# EAGLE design v2 (EAGLE 9.2.0)
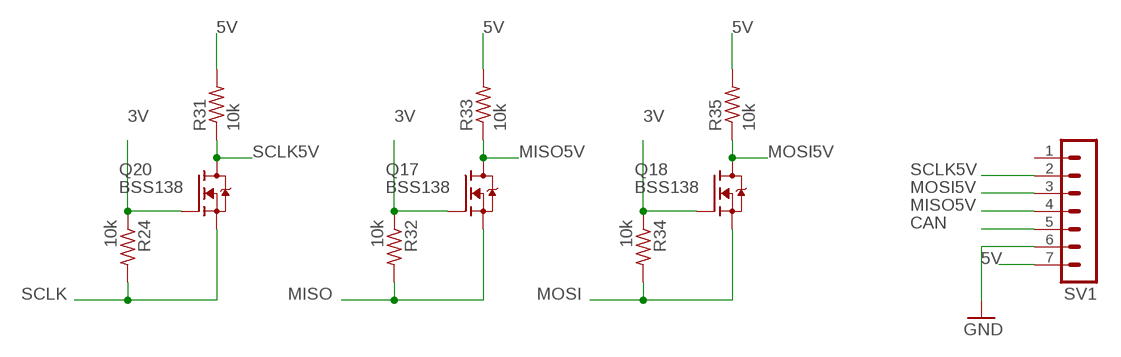
[diagram p0: schematic, sheet 1, part 1 of 2]
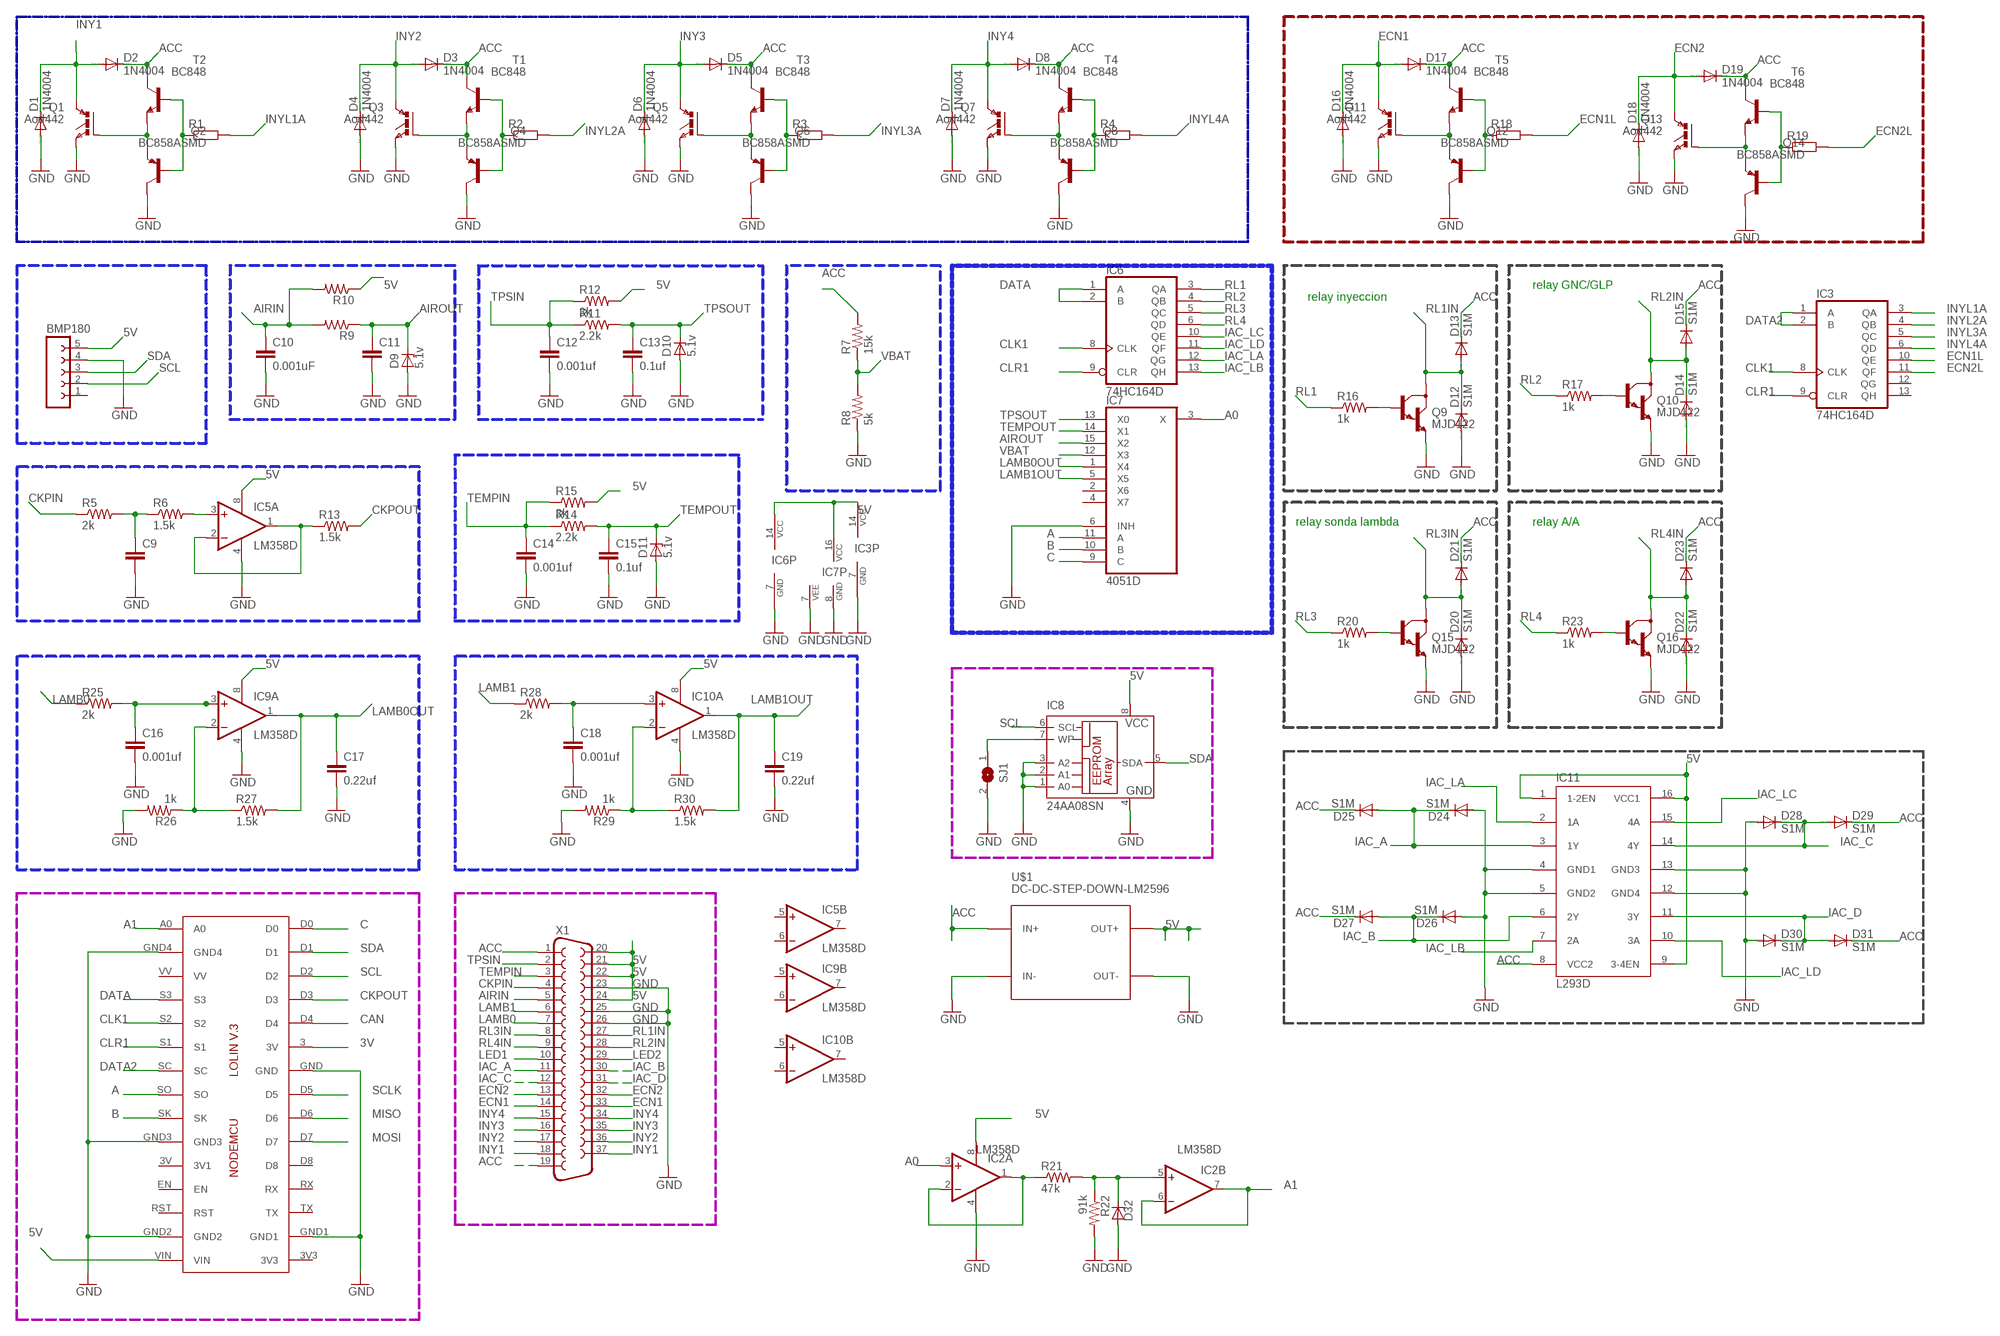
[diagram p1: schematic, sheet 1, part 2 of 2]

## Parts
BMP180  FE05-1  [FE05-1]
C9  C-EU025-025X050  [C025-025X050]
C10  0.001uF  C-EU025-025X050  [C025-025X050]
C11  C-EU025-025X050  [C025-025X050]
C12  0.001uf  C-EU025-025X050  [C025-025X050]
C13  0.1uf  C-EU025-025X050  [C025-025X050]
C14  0.001uf  C-EU025-025X050  [C025-025X050]
C15  0.1uf  C-EU025-025X050  [C025-025X050]
C16  0.001uf  C-EU025-025X050  [C025-025X050]
C17  0.22uf  C-EU025-025X050  [C025-025X050]
C18  0.001uf  C-EU025-025X050  [C025-025X050]
C19  0.22uf  C-EU025-025X050  [C025-025X050]
D1  1N4004  [DO41-10]
D2  1N4004  [DO41-10]
D3  1N4004  [DO41-10]
D4  1N4004  [DO41-10]
D5  1N4004  [DO41-10]
D6  1N4004  [DO41-10]
D7  1N4004  [DO41-10]
D8  1N4004  [DO41-10]
D9  5.1v  ZENER-DIODEZD-5  [ZDIO-5]
D10  5.1v  ZENER-DIODEZD-5  [ZDIO-5]
D11  5.1v  ZENER-DIODEZD-5  [ZDIO-5]
D12  S1M  [SMA]
D13  S1M  [SMA]
D14  S1M  [SMA]
D15  S1M  [SMA]
D16  1N4004  [DO41-10]
D17  1N4004  [DO41-10]
D18  1N4004  [DO41-10]
D19  1N4004  [DO41-10]
D20  S1M  [SMA]
D21  S1M  [SMA]
D22  S1M  [SMA]
D23  S1M  [SMA]
D24  S1M  [SMA]
D25  S1M  [SMA]
D26  S1M  [SMA]
D27  S1M  [SMA]
D28  S1M  [SMA]
D29  S1M  [SMA]
D30  S1M  [SMA]
D31  S1M  [SMA]
D32  ZENER-DIODEZD-2.5  [ZDIO-2.5]
IC1  LOLINV3  [LOLINV3]
IC2  LM358D  [SO08]
IC3  74HC164D  [SO14]
IC5  LM358D  [SO08]
IC6  74HC164D  [SO14]
IC7  4051D  [SO16]
IC8  24AA08SN  [SO-08]
IC9  LM358D  [SO08]
IC10  LM358D  [SO08]
IC11  L293D  [DIL16]
Q1  Aod442  IGBTTO252  [TO252]
Q2  BC858ASMD  [SOT23-BEC]
Q3  Aod442  IGBTTO252  [TO252]
Q4  BC858ASMD  [SOT23-BEC]
Q5  Aod442  IGBTTO252  [TO252]
Q6  BC858ASMD  [SOT23-BEC]
Q7  Aod442  IGBTTO252  [TO252]
Q8  BC858ASMD  [SOT23-BEC]
Q9  MJD122  [DPAK]
Q10  MJD122  [DPAK]
Q11  Aod442  IGBTTO252  [TO252]
Q12  BC858ASMD  [SOT23-BEC]
Q13  Aod442  IGBTTO252  [TO252]
Q14  BC858ASMD  [SOT23-BEC]
Q15  MJD122  [DPAK]
Q16  MJD122  [DPAK]
Q17  BSS138  [SOT23]
Q18  BSS138  [SOT23]
Q20  BSS138  [SOT23]
R1  R-EU_0204/7  [0204/7]
R2  R-EU_0204/7  [0204/7]
R3  R-EU_0204/7  [0204/7]
R4  R-EU_0204/7  [0204/7]
R5  2k  R-US_0204/5  [0204/5]
R6  1.5k  R-US_0204/5  [0204/5]
R7  15k  R-US_0204/5  [0204/5]
R8  5k  R-US_0204/5  [0204/5]
R9  R-US_0204/5  [0204/5]
R10  R-US_0204/5  [0204/5]
R11  2.2k  R-US_0204/5  [0204/5]
R12  3k  R-US_0204/5  [0204/5]
R13  1.5k  R-US_0204/5  [0204/5]
R14  2.2k  R-US_0204/5  [0204/5]
R15  3k  R-US_0204/5  [0204/5]
R16  1k  R-US_0204/5  [0204/5]
R17  1k  R-US_0204/5  [0204/5]
R18  R-EU_0204/7  [0204/7]
R19  R-EU_0204/7  [0204/7]
R20  1k  R-US_0204/5  [0204/5]
R21  47k  R-US_0204/5  [0204/5]
R22  91k  R-US_0204/5  [0204/5]
R23  1k  R-US_0204/5  [0204/5]
R24  10k  R-US_0204/5  [0204/5]
R25  2k  R-US_0204/5  [0204/5]
R26  1k  R-US_0204/5  [0204/5]
R27  1.5k  R-US_0204/5  [0204/5]
R28  2k  R-US_0204/5  [0204/5]
R29  1k  R-US_0204/5  [0204/5]
R30  1.5k  R-US_0204/5  [0204/5]
R31  10k  R-US_0204/5  [0204/5]
R32  10k  R-US_0204/5  [0204/5]
R33  10k  R-US_0204/5  [0204/5]
R34  10k  R-US_0204/5  [0204/5]
R35  10k  R-US_0204/5  [0204/5]
SJ1  SJW  [SJW]
SV1  MA07-1  [MA07-1]
T1  BC848  [SOT23]
T2  BC848  [SOT23]
T3  BC848  [SOT23]
T4  BC848  [SOT23]
T5  BC848  [SOT23]
T6  BC848  [SOT23]
U$1  DC-DC-STEP-DOWN-LM2596  [DC-DC-STEP-DOWN-LM2596]
X1  F37HP  [F37HP]

## Nets
3V: IC1.3(3V) Q17.1(G) Q18.1(G) Q20.1(G) R24.1 R32.1 R34.1
5V: BMP180.5 IC1.VIN IC2.8(P:V+) IC3.14(VCC) IC5.8(P:V+) IC6.14(VCC) IC7.16(VCC) IC8.8(VCC) IC9.8(P:V+) IC10.8(P:V+) IC11.1(1-2EN) IC11.9(3-4EN) IC11.16(VCC1) R10.1 R12.2 R15.2 R31.2 R33.2 R35.2 SV1.7 U$1.OUT+ X1.20 X1.21 X1.22 X1.24
A: IC1.SO IC7.11(A)
A0: IC2.3(A:+IN) IC7.3(X)
A1: IC1.A0 IC2.6(B:-IN) IC2.7(B:OUT)
ACC: D2.C D3.C D5.C D8.C D13.C D15.C D17.C D19.C D21.C D23.C D25.C D27.C D29.C D31.C IC11.8(VCC2) R7.2 T1.3(C) T2.3(C) T3.3(C) T4.3(C) T5.3(C) T6.3(C) U$1.IN+ X1.1 X1.19
AIRIN: C10.1 R9.2 R10.2 X1.5
AIROUT: C11.1 D9.C IC7.15(X2) R9.1
B: IC1.SK IC7.10(B)
C: IC1.D0 IC7.9(C)
CAN: IC1.D4 SV1.5
CKPIN: R5.1 X1.4
CKPOUT: IC1.D3 R13.2
CLK1: IC1.S2 IC3.8(CLK) IC6.8(CLK)
CLR1: IC1.S1 IC3.9(CLR) IC6.9(CLR)
CPKOUT: IC5.1(A:OUT) IC5.2(A:-IN) R13.1
DATA: IC1.S3 IC6.1(A) IC6.2(B)
DATA2: IC1.SC IC3.1(A) IC3.2(B)
ECN1: D16.C D17.A Q11.2(C) X1.14 X1.33
ECN1L: IC3.10(QE) R18.2
ECN2: D18.C D19.A Q13.2(C) X1.13 X1.32
ECN2L: IC3.11(QF) R19.2
GND: BMP180.4 C9.2 C10.2 C11.2 C12.2 C13.2 C14.2 C15.2 C16.2 C17.2 C18.2 C19.2 D1.A D4.A D6.A D7.A D9.A D10.A D11.A D12.A D14.A D16.A D18.A D20.A D22.A D24.A D26.A D28.A D30.A D32.A IC1.GND IC1.GND1 IC1.GND2 IC1.GND3 IC1.GND4 IC2.4(P:V-) IC3.7(GND) IC5.4(P:V-) IC6.7(GND) IC7.6(INH) IC7.7(VEE) IC7.8(GND) IC8.1(A0) IC8.2(A1) IC8.3(A2) IC8.4(GND) IC9.4(P:V-) IC10.4(P:V-) IC11.4(GND1) IC11.5(GND2) IC11.12(GND4) IC11.13(GND3) Q1.3(E) Q2.C Q3.3(E) Q4.C Q5.3(E) Q6.C Q7.3(E) Q8.C Q9.3(E) Q10.3(E) Q11.3(E) Q12.C Q13.3(E) Q14.C Q15.3(E) Q16.3(E) R8.1 R22.2 R26.2 R29.2 SJ1.2 SV1.6 U$1.IN- U$1.OUT- X1.23 X1.25 X1.26
IAC_A: D24.C D25.A IC11.3(1Y) X1.11
IAC_B: D26.C D27.A IC11.6(2Y) X1.30
IAC_C: D28.C D29.A IC11.14(4Y) X1.12
IAC_D: D30.C D31.A IC11.11(3Y) X1.31
IAC_LA: IC6.12(QG) IC11.2(1A)
IAC_LB: IC6.13(QH) IC11.7(2A)
IAC_LC: IC6.10(QE) IC11.15(4A)
IAC_LD: IC6.11(QF) IC11.10(3A)
INY1: D1.C D2.A Q1.2(C) X1.18 X1.37
INY2: D3.A D4.C Q3.2(C) X1.17 X1.36
INY3: D5.A D6.C Q5.2(C) X1.16 X1.35
INY4: D7.C D8.A Q7.2(C) X1.15 X1.34
INYL1A: IC3.3(QA) R1.2
INYL2A: IC3.4(QB) R2.2
INYL3A: IC3.5(QC) R3.2
INYL4A: IC3.6(QD) R4.2
LAMB0: R25.1 X1.7
LAMB0OUT: C17.1 IC7.1(X4) IC9.1(A:OUT) R27.2
LAMB1: R28.1 X1.6
LAMB1OUT: C19.1 IC7.5(X5) IC10.1(A:OUT) R30.2
LED1: X1.10
LED2: X1.29
MISO: IC1.D6 Q17.2(S) R32.2
MISO5V: Q17.3(D) R33.1 SV1.4
MOSI: IC1.D7 Q18.2(S) R34.2
MOSI5V: Q18.3(D) R35.1 SV1.3
N$1: C18.1 IC10.3(A:+IN) R28.2
N$2: Q1.1(G) Q2.E T2.2(E)
N$3: Q2.B R1.1 T2.1(B)
N$4: Q9.1(B) R16.2
N$5: IC5.3(A:+IN) R6.2
N$6: C9.1 R5.2 R6.1
N$8: Q10.1(B) R17.2
N$10: Q3.1(G) Q4.E T1.2(E)
N$11: Q4.B R2.1 T1.1(B)
N$12: D32.C IC2.5(B:+IN) R21.2 R22.1
N$13: Q11.1(G) Q12.E T5.2(E)
N$14: IC2.1(A:OUT) IC2.2(A:-IN) R21.1
N$15: Q12.B R18.1 T5.1(B)
N$17: Q5.1(G) Q6.E T3.2(E)
N$18: Q6.B R3.1 T3.1(B)
N$19: Q15.1(B) R20.2
N$20: Q13.1(G) Q14.E T6.2(E)
N$22: Q14.B R19.1 T6.1(B)
N$24: Q7.1(G) Q8.E T4.2(E)
N$25: Q8.B R4.1 T4.1(B)
N$29: Q16.1(B) R23.2
N$31: C16.1 IC9.3(A:+IN) R25.2
N$32: IC9.2(A:-IN) R26.1 R27.1
N$34: IC8.7(WP) SJ1.1
N$37: IC10.2(A:-IN) R29.1 R30.1
RL1: IC6.3(QA) R16.1
RL1IN: D12.C D13.A Q9.4(C) X1.27
RL2: IC6.4(QB) R17.1
RL2IN: D14.C D15.A Q10.4(C) X1.28
RL3: IC6.5(QC) R20.1
RL3IN: D20.C D21.A Q15.4(C) X1.8
RL4: IC6.6(QD) R23.1
RL4IN: D22.C D23.A Q16.4(C) X1.9
SCL: BMP180.2 IC1.D2 IC8.6(SCL)
SCLK: IC1.D5 Q20.2(S) R24.2
SCLK5V: Q20.3(D) R31.1 SV1.2
SDA: BMP180.3 IC1.D1 IC8.5(SDA)
TEMPIN: C14.1 R14.1 R15.1 X1.3
TEMPOUT: C15.1 D11.C IC7.14(X1) R14.2
TPSIN: C12.1 R11.1 R12.1 X1.2
TPSOUT: C13.1 D10.C IC7.13(X0) R11.2
VBAT: IC7.12(X3) R7.1 R8.2
Unconnected: BMP180.1 IC1.3V3 IC1.3V(3V1) IC1.D8 IC1.EN IC1.RST IC1.RX IC1.TX IC1.VV IC3.12(QG) IC3.13(QH) IC5.5(B:+IN) IC5.6(B:-IN) IC5.7(B:OUT) IC7.2(X6) IC7.4(X7) IC9.5(B:+IN) IC9.6(B:-IN) IC9.7(B:OUT) IC10.5(B:+IN) IC10.6(B:-IN) IC10.7(B:OUT) SV1.1

## Buses
B$1

## Notes on the sheet
- relay GNC/GLP
- relay inyeccion
- relay sonda lambda | relay A/A

## Library data of the parts
BMP180 = con-lsta:FE05-1: FEMALE HEADER; OC_FARNELL: unknown; OC_NEWARK: unknown
C9-C19 = rcl:C-EU: CAPACITOR, European symbol; SPICEPREFIX: C
D1-D8 D16-D19 = diode:1N4004: DIODE general purpose rectifier, 1 A
D9-D11 D32 = diode:ZENER-DIODE: Z-Diode
D12-D15 D20-D31 = diode:S1M
IC1 = Lolin:LOLINV3
IC2 IC5 IC9 IC10 = linear:LM358: OP AMP also LM158; LM258; LM2904 Source: http://cache.national.com/ds/LM/LM158.pdf
IC3 IC6 = 74xx-us:74*164: 8-bit parallel out SHIFT REGISTER
IC7 = 40xx:4051: 8-channel ANALOG MULTIPLEXER
IC8 = microchip:24*: Serial EEPROM I2C; MF: MICROCHIP; MPN: 24AA08-I/SN; OC_FARNELL: 1579568; OC_NEWARK: 92C6826
IC11 = st-microelectronics:L293D: PUSH-PULL 4 CHANNEL DRIVER
Q1 Q3 Q5 Q7 Q11 Q13 = IGBT:IGBT: IGBT
Q2 Q4 Q6 Q8 Q12 Q14 = transistor-pnp:BC858*: PNP Transistror
Q9 Q10 Q15 Q16 = MJD122:MJD122: TRANS DARL NPN 100V 5A DPAK; AVAILABILITY: Unavailable; MF: STMicroelectronics; MP: MJD122; PACKAGE: None; PRICE: None
Q17 Q18 Q20 = bss138_10:BSS138: BSS138 N-Channel Logic Level Enhancement Mode Field Effect Transistor Source: http://www.fairchildsemi.com/datasheets/BS/BSS138.pdf; MF: Fairchild; MPN: BSS138; OC_FARNELL: 9845330; OC_NEWARK: 67R2009
R1-R4 R18 R19 = rcl:R-EU_: RESISTOR, European symbol; SPICEPREFIX: R
R5-R17 R20-R35 = rcl:R-US_: RESISTOR, American symbol; SPICEPREFIX: R
SJ1 = jumper:SJ: SMD solder JUMPER
SV1 = con-lstb:MA07-1: PIN HEADER; OC_FARNELL: unknown; OC_NEWARK: unknown
T1-T6 = transistor:BC848: NPN TRANSISTOR
U$1 = diy-modules:DC-DC-STEP-DOWN-LM2596: DC/DC Step-Down Regulator based on LM2596-ADJ chip LM2596 datasheet available here: http://www.ti.com/lit/ds/symlink/lm2596.pdf Click here to find device on ebay.com <http://www.ebay.com/sch/lm2596+power+regulator>
X1 = con-subd:F37: SUB-D; OC_FARNELL: unknown; OC_NEWARK: unknown

## Board
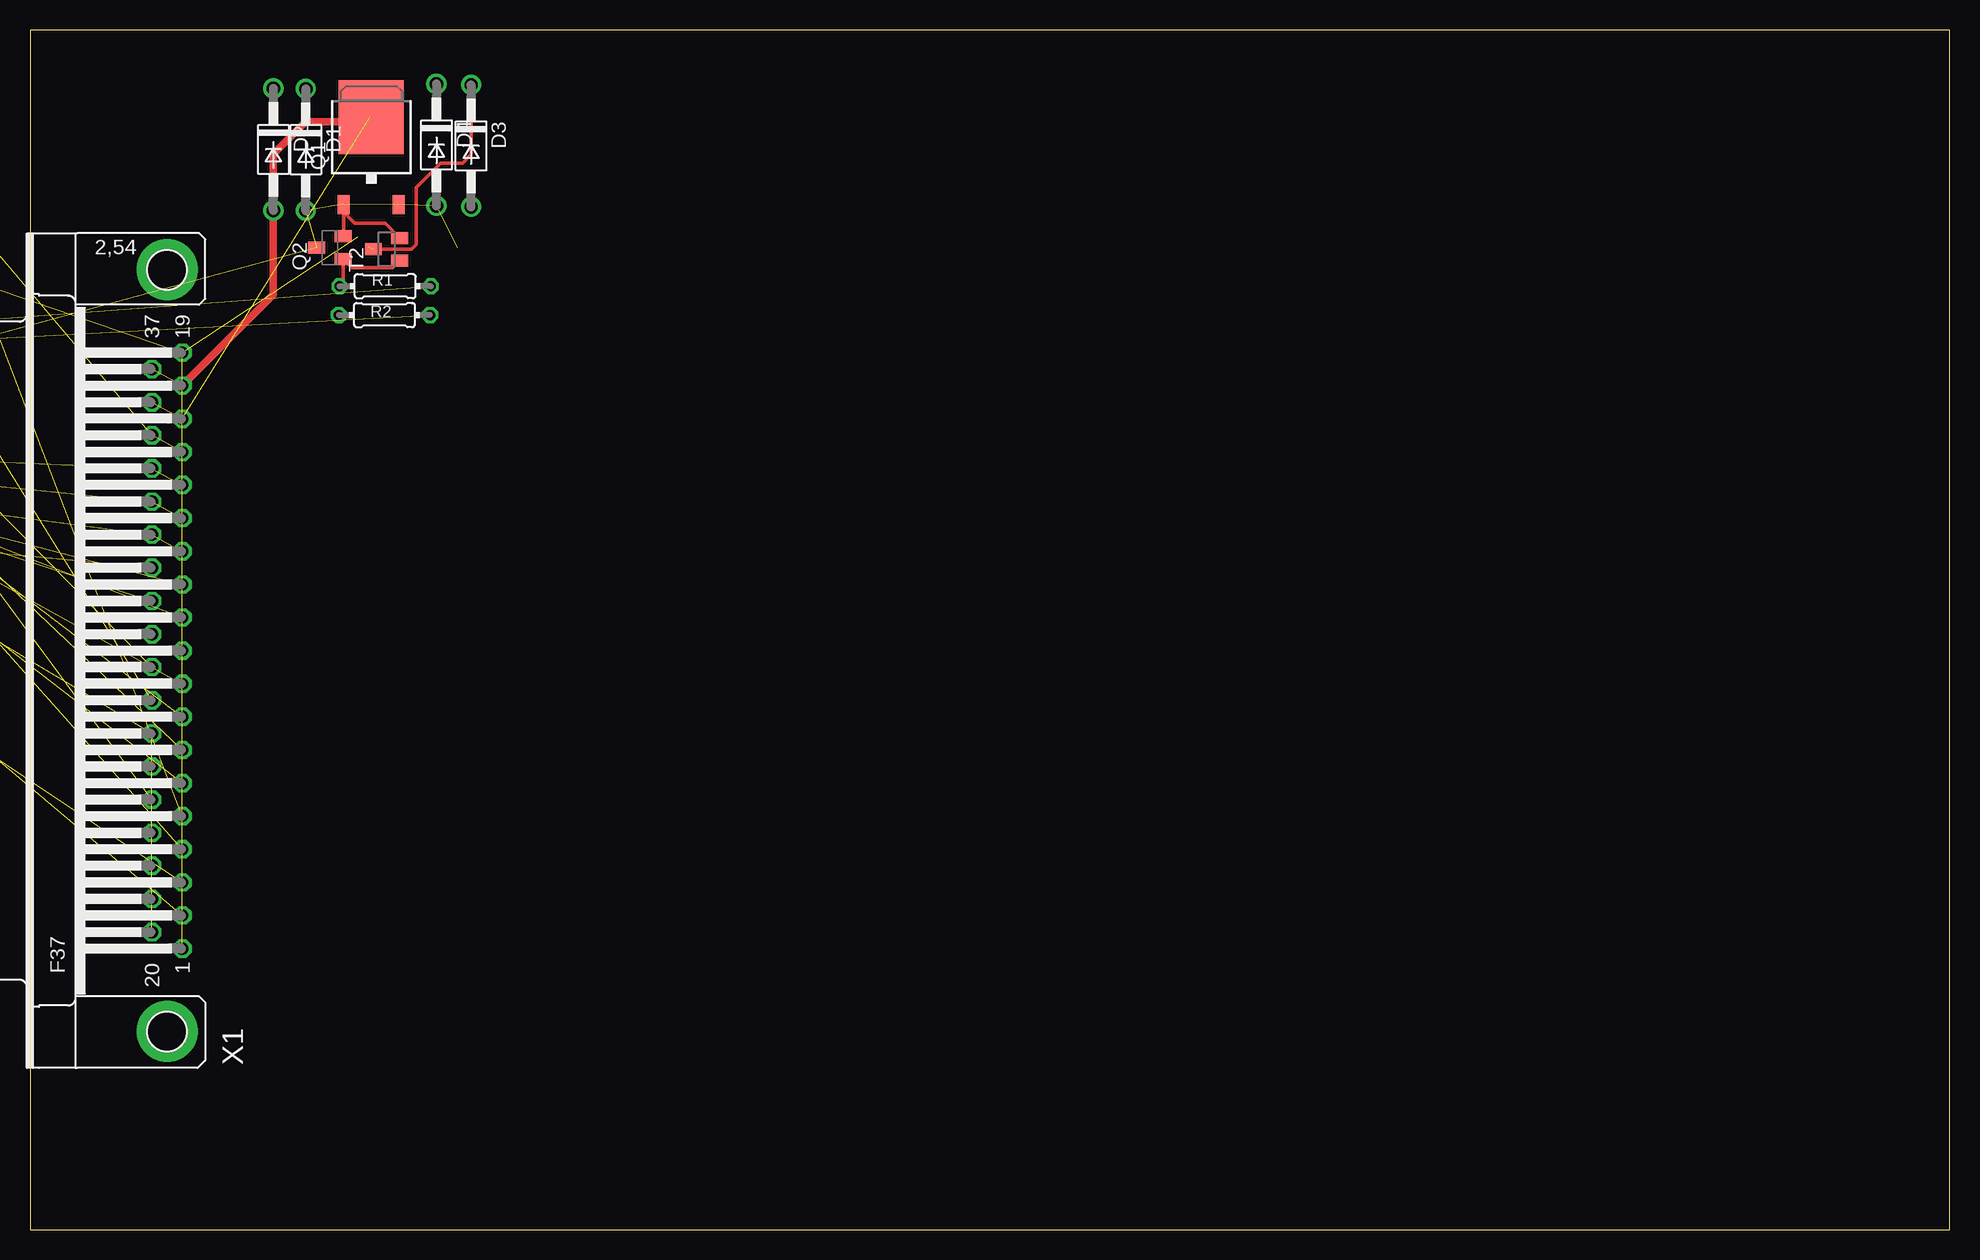
[diagram p2: board, top side]
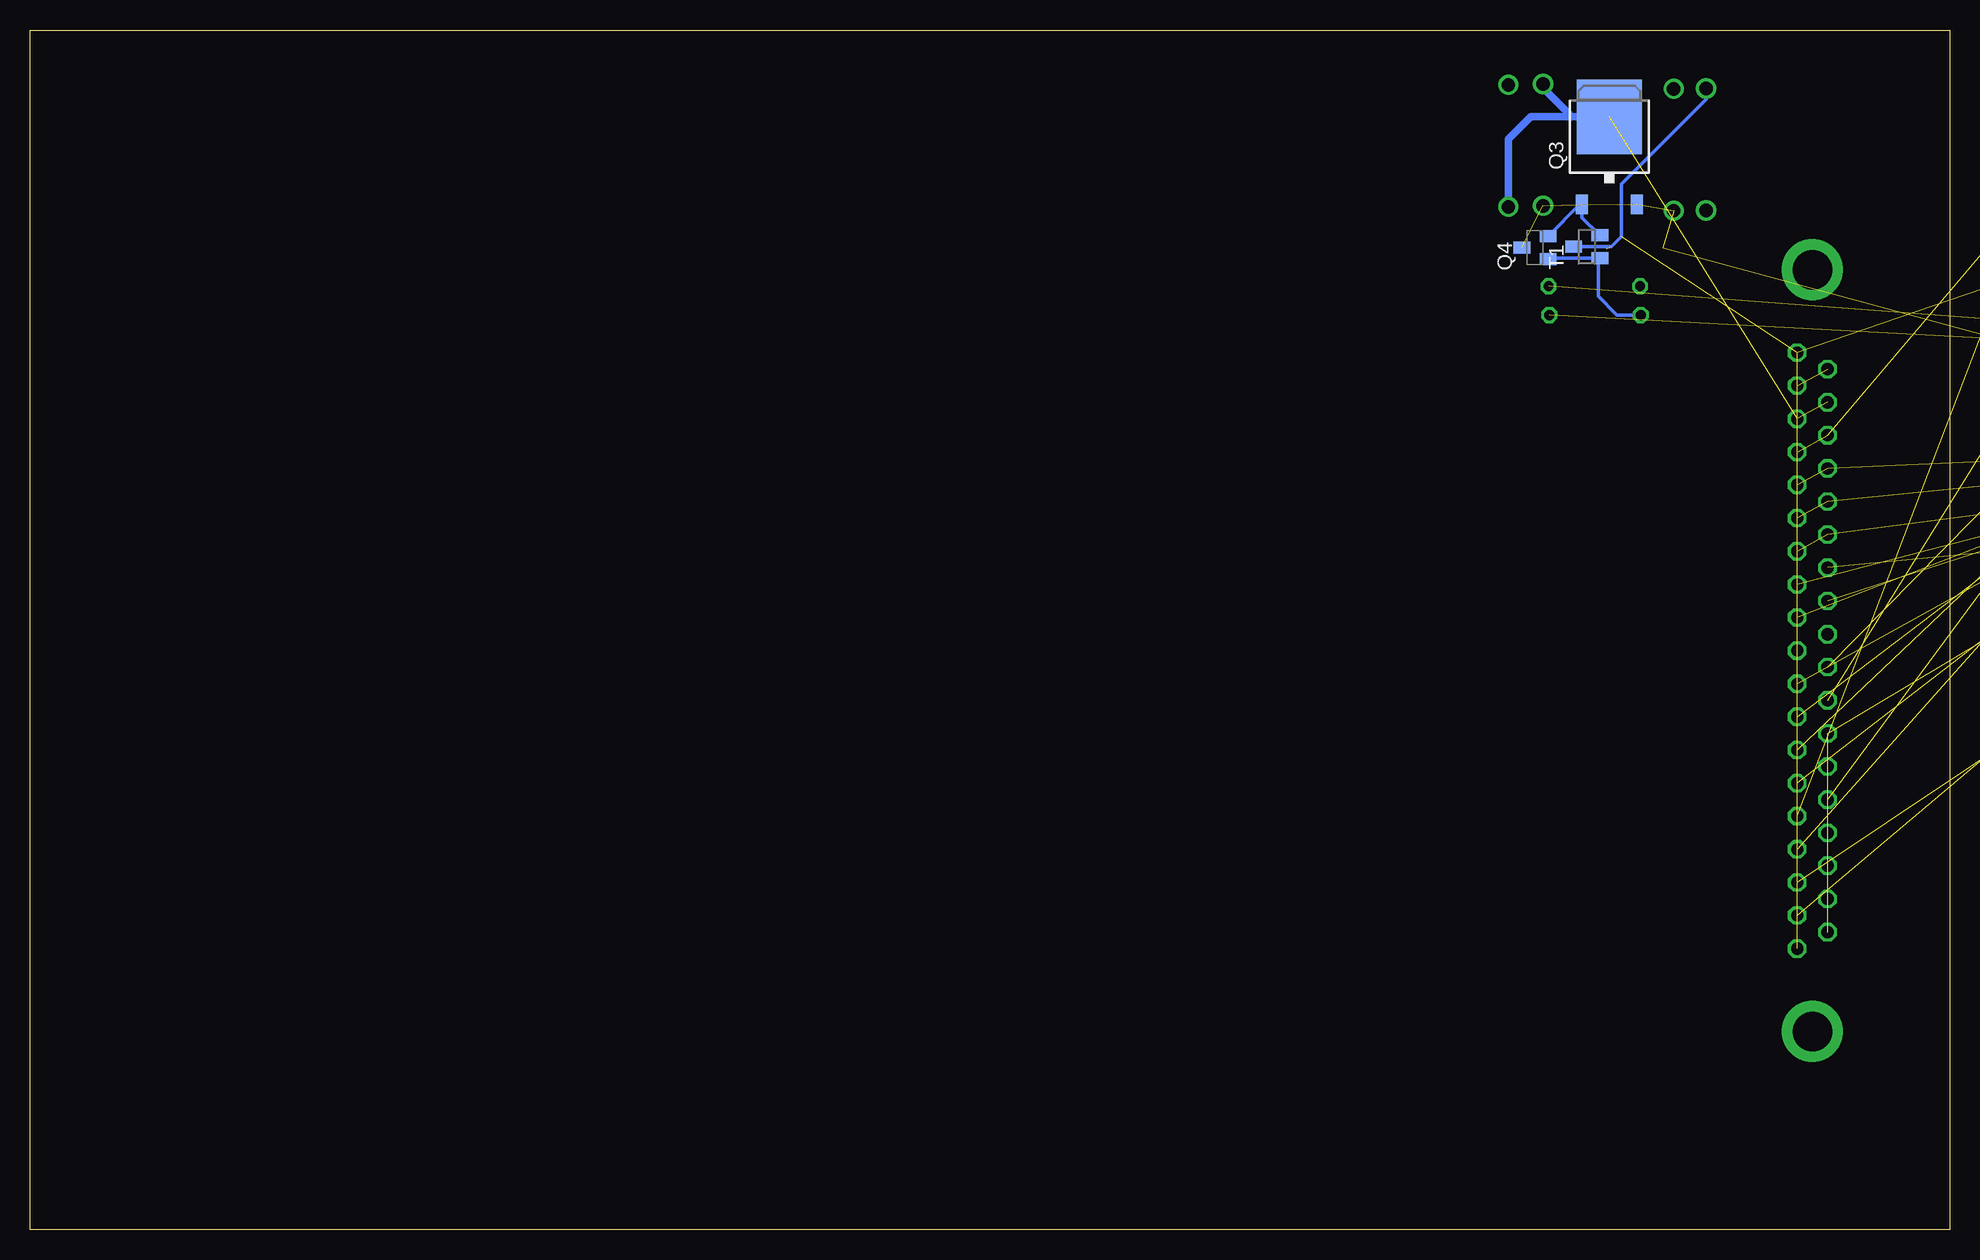
[diagram p3: board, bottom side, seen from below]

Size 160 x 100 mm. Coordinates in mm from the lower left corner, seen from the top.
Outline: 0,0 160,0 160,100 0,100 0,0
Copper layers (1*16): Top 0.035mm / dielectric 1.5mm / Bottom 0.035mm
Design rules "default": minimum track width 6mil, minimum drill 0.35mm, track to track 6mil, track to pad 6mil, pad to pad 6mil, via to via 6mil, smd to smd 6mil, copper to edge 40mil, drill to drill 6mil, minimum pad ring 10mil, minimum via ring 8mil, stop-mask expansion 4mil, vias tented up to drill 0mil, thermal gap 10mil

### Footprints (pad centres in the part's own frame; a part is rotated, then mirrored left to right if it is on the bottom)
FE05-1 = drill 0.813 long: 1 -5.08,0; 2 -2.54,0; 3 0,0; 4 2.54,0; 5 5.08,0
C025-025X050 = drill 0.813 octagon: 1 -1.27,0; 2 1.27,0
DO41-10 = drill 1.118: A 5.08,0; C -5.08,0
ZDIO-5 = drill 0.813 octagon: A 2.54,0; C -2.54,0
SMA = smd 2 x 2: A 2,0; C -2,0
ZDIO-2.5 = drill 0.813 octagon: A 1.27,0; C -1.27,0
LOLINV3 = drill 0.8 pad 1.778 square: 3 24.03,27.94; 3V 46.99,27.94; 3V3 36.83,1.27; A0 11.43,1.27; D0 11.43,27.94; D1 13.97,27.94; D2 16.51,27.94; D3 19.05,27.94; D4 21.59,27.94; D5 29.21,27.94; D6 31.75,27.94; D7 34.29,27.94; D8 36.83,27.94; EN 39.37,1.27; GND 26.67,27.94; GND1 44.45,27.94; GND2 44.45,1.27; GND3 34.29,1.27; GND4 13.97,1.27; RST 41.91,1.27; RX 39.37,27.94; S1 24.13,1.27; S2 21.59,1.27; S3 19.05,1.27; SC 26.67,1.27; SK 31.75,1.27; SO 29.21,1.27; TX 41.91,27.94; VIN 46.99,1.27; VV 16.51,1.27 | hole 2.8: 56.5,28; 56.5,1.5; 1.5,1.5; 1.5,28
SO08 = smd 0.6 x 2.2: 1 -1.905,-2.6; 2 -0.635,-2.6; 3 0.635,-2.6; 4 1.905,-2.6; 5 1.905,2.6; 6 0.635,2.6; 7 -0.635,2.6; 8 -1.905,2.6
SO14 = smd 0.66 x 2.032: 1 -3.81,-3.073; 2 -2.54,-3.073; 3 -1.27,-3.073; 4 0,-3.073; 5 1.27,-3.073; 6 2.54,-3.073; 7 3.81,-3.073; 8 3.81,3.073; 9 2.54,3.073; 10 1.27,3.073; 11 0,3.073; 12 -1.27,3.073; 13 -2.54,3.073; 14 -3.81,3.073
SO16 = smd 0.66 x 2.032: 1 -4.445,-3.073; 2 -3.175,-3.073; 3 -1.905,-3.073; 4 -0.635,-3.073; 5 0.635,-3.073; 6 1.905,-3.073; 7 3.175,-3.073; 8 4.445,-3.073; 9 4.445,3.073; 10 3.175,3.073; 11 1.905,3.073; 12 0.635,3.073; 13 -0.635,3.073; 14 -1.905,3.073; 15 -3.175,3.073; 16 -4.445,3.073
SO-08 = smd 0.6 x 2.2: 1 -1.905,-2.6; 2 -0.635,-2.6; 3 0.635,-2.6; 4 1.905,-2.6; 5 1.905,2.6; 6 0.635,2.6; 7 -0.635,2.6; 8 -1.905,2.6
DIL16 = drill 0.813 long: 1 -8.89,-3.81; 2 -6.35,-3.81; 3 -3.81,-3.81; 4 -1.27,-3.81; 5 1.27,-3.81; 6 3.81,-3.81; 7 6.35,-3.81; 8 8.89,-3.81; 9 8.89,3.81; 10 6.35,3.81; 11 3.81,3.81; 12 1.27,3.81; 13 -1.27,3.81; 14 -3.81,3.81; 15 -6.35,3.81; 16 -8.89,3.81
TO252 = smd 1 x 1.6: 1 -2.28,-4.8; 3 2.28,-4.8 | smd 5.4 x 6.2: 2 0,2.5
SOT23-BEC = smd 1 x 1.4: B -0.95,-1.1; C 0,1.1; E 0.95,-1.1
DPAK = smd 1.6 x 2.997: 1 -2.261,-4.928; 3 2.21,-4.928 | smd 5.452 x 7: 4 0,1.853
SOT23 = smd 0.8 x 0.9: 1 -0.95,-1; 2 0.95,-1; 3 0,1
0204/7 = drill 0.813 octagon: 1 -3.81,0; 2 3.81,0
0204/5 = drill 0.813 octagon: 1 -2.54,0; 2 2.54,0
SJW = smd 1.27 x 2.54: 1 -1.27,0; 2 1.27,0
MA07-1 = drill 1.016 long: 1 -7.62,0; 2 -5.08,0; 3 -2.54,0; 4 0,0; 5 2.54,0; 6 5.08,0; 7 7.62,0
SOT23' = smd 1 x 1.4: 1 -0.95,-1.1; 2 0.95,-1.1; 3 0,1.1
DC-DC-STEP-DOWN-LM2596 = drill 1.5 pad 2.5 square: IN+ -19.812,8.636; IN- -19.812,-8.636; OUT+ 19.812,8.636; OUT- 19.812,-8.636
F37HP = drill 1.016 octagon: 1 -24.841,-1.27; 2 -22.073,-1.27; 3 -19.329,-1.27; 4 -16.561,-1.27; 5 -13.792,-1.27; 6 -11.049,-1.27; 7 -8.28,-1.27; 8 -5.512,-1.27; 9 -2.769,-1.27; 10 0,-1.27; 11 2.769,-1.27; 12 5.512,-1.27; 13 8.28,-1.27; 14 11.049,-1.27; 15 13.818,-1.27; 16 16.561,-1.27; 17 19.329,-1.27; 18 22.098,-1.27; 19 24.841,-1.27; 20 -23.47,1.27; 21 -20.701,1.27; 22 -17.932,1.27; 23 -15.189,1.27; 24 -12.421,1.27; 25 -9.652,1.27; 26 -6.909,1.27; 27 -4.14,1.27; 28 -1.372,1.27; 29 1.372,1.27; 30 4.14,1.27; 31 6.909,1.27; 32 9.677,1.27; 33 12.421,1.27; 34 15.189,1.27; 35 17.958,1.27; 36 20.701,1.27; 37 23.47,1.27 | drill 3.302 pad 5.08: G1 -31.75,0; G2 31.75,0

### Placement (x,y rotation side)
BMP180  -49.53,125.73 0 top  (outside the outline)
C9  -60.96,125.73 0 top  (outside the outline)
C10  -106.68,106.68 0 top  (outside the outline)
C11  -67.31,125.73 0 top  (outside the outline)
C12  -114.3,106.68 0 top  (outside the outline)
C13  -44.45,114.3 0 top  (outside the outline)
C14  -121.92,106.68 0 top  (outside the outline)
C15  -50.8,114.3 0 top  (outside the outline)
C16  -17.78,114.3 0 top  (outside the outline)
C17  -31.75,114.3 0 top  (outside the outline)
C18  -25.4,114.3 0 top  (outside the outline)
C19  -38.1,114.3 0 top  (outside the outline)
D1  22.99,90.01 270 top
D2  20.29,90.04 270 top
D3  36.77,90.34 270 top
D4  33.88,90.42 270 top
D5  -119.38,99.06 0 top  (outside the outline)
D6  -19.05,106.68 0 top  (outside the outline)
D7  -31.75,106.68 0 top  (outside the outline)
D8  -44.45,106.68 0 top  (outside the outline)
D9  -24.13,99.06 0 top  (outside the outline)
D10  -31.75,99.06 0 top  (outside the outline)
D11  -39.37,99.06 0 top  (outside the outline)
D12  -119.38,73.66 0 top  (outside the outline)
D13  -16.51,83.82 0 top  (outside the outline)
D14  -24.13,83.82 0 top  (outside the outline)
D15  -31.75,83.82 0 top  (outside the outline)
D16  -57.15,106.68 0 top  (outside the outline)
D17  -69.85,106.68 0 top  (outside the outline)
D18  -82.55,106.68 0 top  (outside the outline)
D19  -95.25,106.68 0 top  (outside the outline)
D20  -39.37,83.82 0 top  (outside the outline)
D21  -46.99,83.82 0 top  (outside the outline)
D22  -54.61,83.82 0 top  (outside the outline)
D23  -62.23,83.82 0 top  (outside the outline)
D24  -69.85,83.82 0 top  (outside the outline)
D25  -77.47,83.82 0 top  (outside the outline)
D26  -85.09,83.82 0 top  (outside the outline)
D27  -92.71,83.82 0 top  (outside the outline)
D28  -100.33,83.82 0 top  (outside the outline)
D29  -107.95,83.82 0 top  (outside the outline)
D30  -115.57,83.82 0 top  (outside the outline)
D31  -123.19,83.82 0 top  (outside the outline)
D32  -73.66,124.46 0 top  (outside the outline)
IC1  -175.26,88.9 270 top  (outside the outline)
IC2  -17.78,73.66 0 top  (outside the outline)
IC3  -72.39,73.66 0 top  (outside the outline)
IC5  -27.94,73.66 0 top  (outside the outline)
IC6  -85.09,73.66 0 top  (outside the outline)
IC7  -58.42,73.66 0 top  (outside the outline)
IC8  -92.71,60.96 0 top  (outside the outline)
IC9  -38.1,73.66 0 top  (outside the outline)
IC10  -48.26,73.66 0 top  (outside the outline)
IC11  -107.95,62.23 0 top  (outside the outline)
Q1  28.45,90.23 0 top
Q2  25,81.86 90 top
Q3  28.35,90.26 0 bottom
Q4  34.55,81.86 90 bottom
Q5  -113.03,38.1 0 top  (outside the outline)
Q6  -48.26,91.44 0 top  (outside the outline)
Q7  -19.05,62.23 0 top  (outside the outline)
Q8  -60.96,91.44 0 top  (outside the outline)
Q9  -82.55,62.23 0 top  (outside the outline)
Q10  -54.61,63.5 0 top  (outside the outline)
Q11  -30.48,62.23 0 top  (outside the outline)
Q12  -73.66,91.44 0 top  (outside the outline)
Q13  -41.91,62.23 0 top  (outside the outline)
Q14  -86.36,91.44 0 top  (outside the outline)
Q15  -64.77,63.5 0 top  (outside the outline)
Q16  -74.93,63.5 0 top  (outside the outline)
Q17  -96.52,71.12 0 top  (outside the outline)
Q18  -104.14,71.12 0 top  (outside the outline)
Q20  -111.76,71.12 0 top  (outside the outline)
R1  29.6,78.64 0 top
R2  29.54,76.23 0 top
R3  -101.6,124.46 0 top  (outside the outline)
R4  -111.76,124.46 0 top  (outside the outline)
R5  -57.15,113.03 0 top  (outside the outline)
R6  -64.77,113.03 0 top  (outside the outline)
R7  -72.39,113.03 0 top  (outside the outline)
R8  -80.01,113.03 0 top  (outside the outline)
R9  -26.67,130.81 0 top  (outside the outline)
R10  -34.29,130.81 0 top  (outside the outline)
R11  -87.63,113.03 0 top  (outside the outline)
R12  -95.25,113.03 0 top  (outside the outline)
R13  -102.87,113.03 0 top  (outside the outline)
R14  -110.49,113.03 0 top  (outside the outline)
R15  -118.11,113.03 0 top  (outside the outline)
R16  -16.51,120.65 0 top  (outside the outline)
R17  -24.13,120.65 0 top  (outside the outline)
R18  -121.92,124.46 0 top  (outside the outline)
R19  -17.78,130.81 0 top  (outside the outline)
R20  -31.75,120.65 0 top  (outside the outline)
R21  -39.37,120.65 0 top  (outside the outline)
R22  -46.99,120.65 0 top  (outside the outline)
R23  -54.61,120.65 0 top  (outside the outline)
R24  -62.23,120.65 0 top  (outside the outline)
R25  -69.85,120.65 0 top  (outside the outline)
R26  -77.47,120.65 0 top  (outside the outline)
R27  -85.09,120.65 0 top  (outside the outline)
R28  -92.71,120.65 0 top  (outside the outline)
R29  -100.33,120.65 0 top  (outside the outline)
R30  -107.95,120.65 0 top  (outside the outline)
R31  -115.57,120.65 0 top  (outside the outline)
R32  -123.19,120.65 0 top  (outside the outline)
R33  -16.51,127 0 top  (outside the outline)
R34  -24.13,127 0 top  (outside the outline)
R35  -31.75,127 0 top  (outside the outline)
SJ1  -38.1,125.73 0 top  (outside the outline)
SV1  -52.07,99.06 0 top  (outside the outline)
T1  BC848  [SOT23']  30.24,81.93 90 bottom
T2  BC848  [SOT23']  29.72,81.72 90 top
T3  BC848  [SOT23']  -109.22,91.44 0 top  (outside the outline)
T4  BC848  [SOT23']  -116.84,91.44 0 top  (outside the outline)
T5  BC848  [SOT23']  -124.46,91.44 0 top  (outside the outline)
T6  BC848  [SOT23']  -17.78,99.06 0 top  (outside the outline)
U$1  -95.25,13.97 0 top  (outside the outline)
X1  11.43,48.26 90 top

### Tracks (layer width: path | path; a pad name or v marks a point on that pad's centre or on a via)
3V  (6 unrouted)
5V  (24 unrouted)
A  (1 unrouted)
A0  (1 unrouted)
A1  (2 unrouted)
ACC  (22 unrouted)
  Top 0.305: T2.3 31.81,81.72 32.18,82.09 32.18,86.86 34.23,88.91 36.05,88.91 36.77,89.63 D3.C
  Bottom 0.152: 27.34,87.17 27.31,87.19
  Bottom 0.305: T1.3 28.2,81.93 27.34,82.78 27.34,87.17 | 27.31,87.19 20.29,94.21 D2.C
AIRIN  (3 unrouted)
AIROUT  (3 unrouted)
B  (1 unrouted)
C  (1 unrouted)
CAN  (1 unrouted)
CKPIN  (1 unrouted)
CKPOUT  (1 unrouted)
CLK1  (2 unrouted)
CLR1  (2 unrouted)
CPKOUT  (2 unrouted)
DATA  (2 unrouted)
DATA2  (2 unrouted)
ECN1  (4 unrouted)
ECN1L  (1 unrouted)
ECN2  (4 unrouted)
ECN2L  (1 unrouted)
GND  (78 unrouted)
IAC_A  (3 unrouted)
IAC_B  (3 unrouted)
IAC_C  (3 unrouted)
IAC_D  (3 unrouted)
IAC_LA  (1 unrouted)
IAC_LB  (1 unrouted)
IAC_LC  (1 unrouted)
IAC_LD  (1 unrouted)
INY1  (1 unrouted)
  Top 0.61: X1.18 20.29,77.95 D2.A 20.29,89.65 22.99,92.35 | 22.99,92.35 D1.C | 22.99,92.35 28.07,92.35 Q1.2
INY2  (2 unrouted)
  Bottom 0.61: Q3.2 29.85,92.76 31.45,92.76 | D4.C 33.88,95.19 31.67,92.98 31.45,92.76 | 31.45,92.76 34.89,92.76 36.77,90.89 D3.A
INY3  (4 unrouted)
INY4  (4 unrouted)
INYL1A  (1 unrouted)
INYL2A  (1 unrouted)
INYL3A  (1 unrouted)
INYL4A  (1 unrouted)
LAMB0  (1 unrouted)
LAMB0OUT  (3 unrouted)
LAMB1  (1 unrouted)
LAMB1OUT  (3 unrouted)
MISO  (2 unrouted)
MISO5V  (2 unrouted)
MOSI  (2 unrouted)
MOSI5V  (2 unrouted)
N$1  (2 unrouted)
N$2
  Top 0.305: Q2.E 26.16,82.87 26.16,84.79 | Q1.1 26.16,85.25 26.16,84.79 | T2.2 29.59,83.9 27.06,83.9 26.16,84.79
N$3
  Top 0.305: T2.1 30.25,80.2 26.81,80.2 Q2.B 26.1,78.95 R1.1
N$4  (1 unrouted)
N$5  (1 unrouted)
N$6  (2 unrouted)
N$8  (1 unrouted)
N$10
  Bottom 0.305: Q4.E 30.8,85.46 Q3.1 30.63,84.37 T1.2
N$11
  Bottom 0.305: T1.1 29.28,80.98 | 29.28,80.98 33.38,80.98 Q4.B | R2.1 27.71,76.23 29.28,77.8 29.28,80.98
N$12  (3 unrouted)
N$13  (2 unrouted)
N$14  (2 unrouted)
N$15  (2 unrouted)
N$17  (2 unrouted)
N$18  (2 unrouted)
N$19  (1 unrouted)
N$20  (2 unrouted)
N$22  (2 unrouted)
N$24  (2 unrouted)
N$25  (2 unrouted)
N$29  (1 unrouted)
N$31  (2 unrouted)
N$32  (2 unrouted)
N$34  (1 unrouted)
N$37  (2 unrouted)
RL1  (1 unrouted)
RL1IN  (3 unrouted)
RL2  (1 unrouted)
RL2IN  (3 unrouted)
RL3  (1 unrouted)
RL3IN  (3 unrouted)
RL4  (1 unrouted)
RL4IN  (3 unrouted)
SCL  (2 unrouted)
SCLK  (2 unrouted)
SCLK5V  (2 unrouted)
SDA  (2 unrouted)
TEMPIN  (3 unrouted)
TEMPOUT  (3 unrouted)
TPSIN  (3 unrouted)
TPSOUT  (3 unrouted)
VBAT  (2 unrouted)